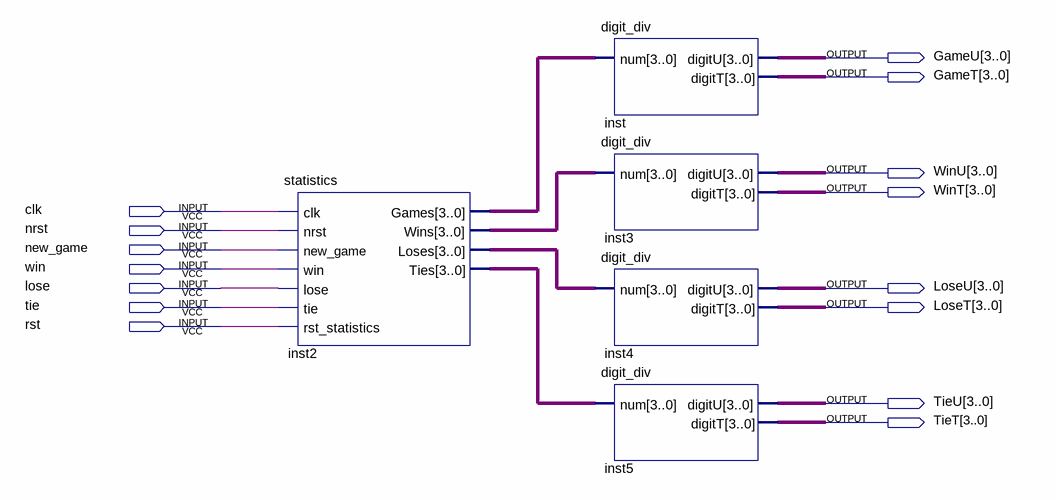
[diagram p0: schematic sheet]
// Quartus schematic satatistic_sim.bdf as structural Verilog: 5 symbols, 15 pins
module satatistic_sim (
  input  clk,
  input  nrst,
  input  new_game,
  input  win,
  input  lose,
  input  tie,
  input  rst,
  output [3:0] GameU,
  output [3:0] GameT,
  output [3:0] WinU,
  output [3:0] WinT,
  output [3:0] LoseU,
  output [3:0] LoseT,
  output [3:0] TieU,
  output [3:0] TieT
);

  wire [3:0] inst2_games, inst2_loses, inst2_ties, inst2_wins;

  statistics inst2 (
    .clk(clk), .nrst(nrst), .new_game(new_game), .win(win), .lose(lose), .tie(tie), .rst_statistics(rst),
    .Games(inst2_games), .Wins(inst2_wins), .Loses(inst2_loses), .Ties(inst2_ties));
  digit_div inst (.num(inst2_games), .digitU(GameU), .digitT(GameT));
  digit_div inst3 (.num(inst2_wins), .digitU(WinU), .digitT(WinT));
  digit_div inst4 (.num(inst2_loses), .digitU(LoseU), .digitT(LoseT));
  digit_div inst5 (.num(inst2_ties), .digitU(TieU), .digitT(TieT));
endmodule
